# Altium project PCB_FinalProject.PrjPcb
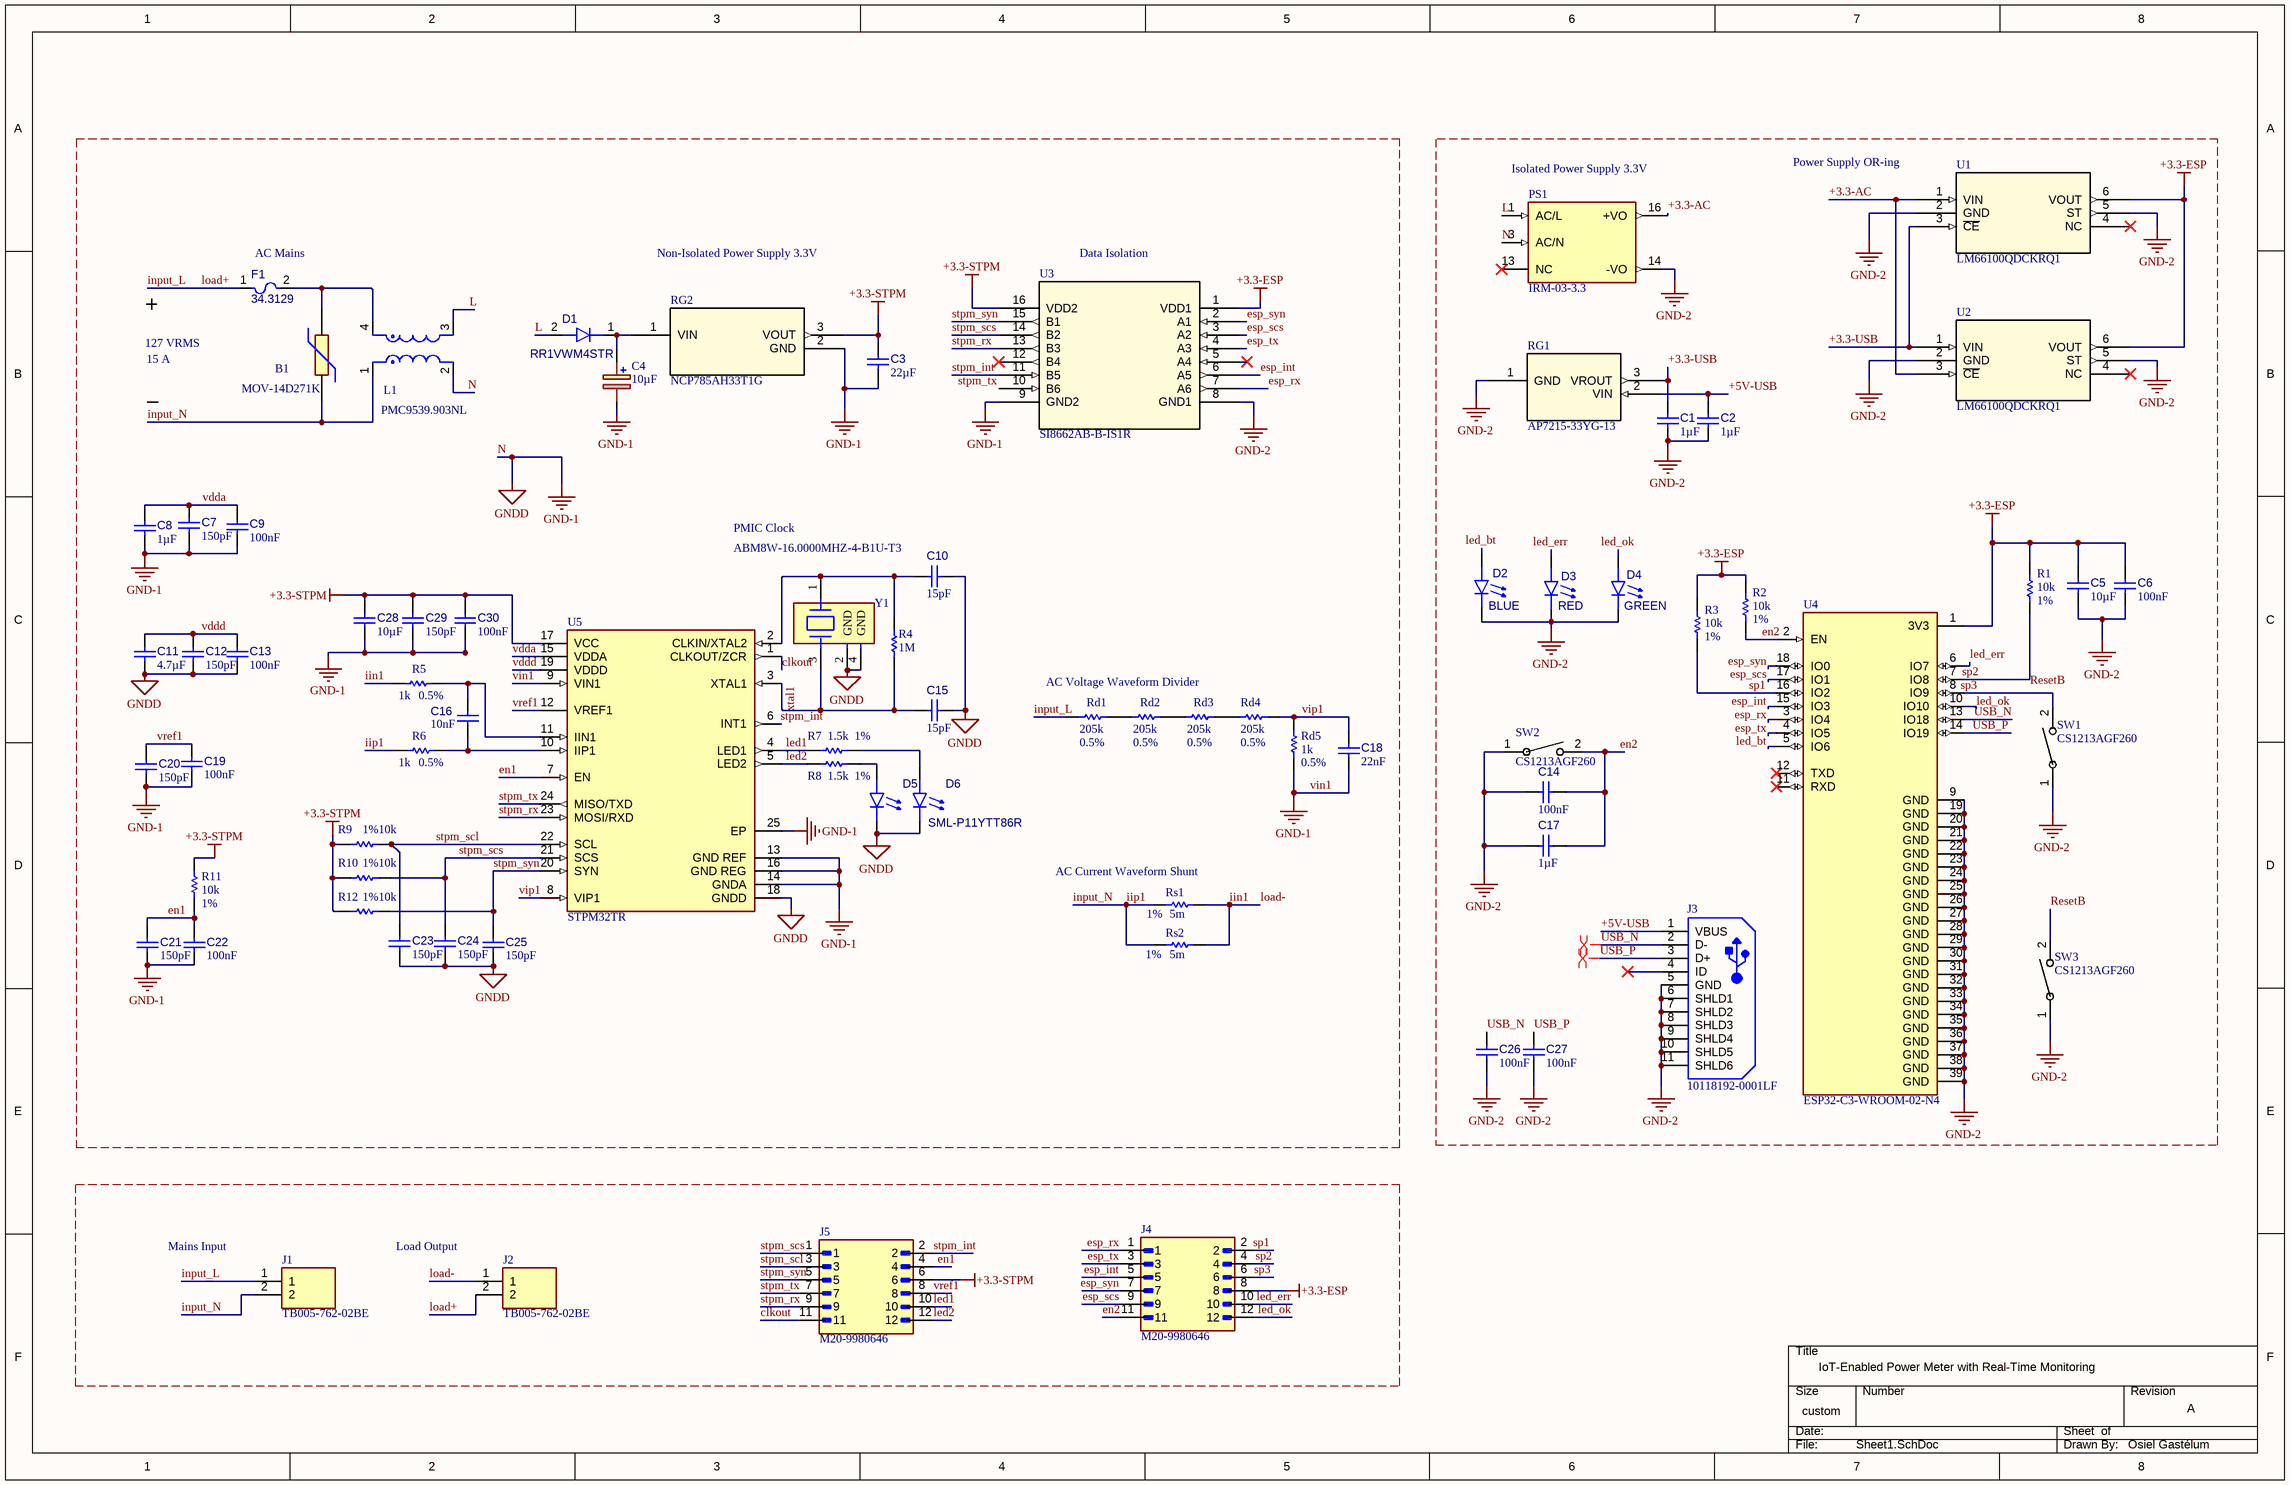
[diagram p0: Sheet1.SchDoc]
CAGE_CODE: ?????; CONTRACT_NUMBER: <CONTRACT NO>; DOC_NO_ASSY_DWG: <ASSY DWG NO>; DOC_NO_BOM: <BOM DOC NO>; DOC_NO_FAB_DWG: <FAB DWG NO>; DOC_NO_SCH_DWG: <SCH DWG NO>; PCB_2_DEC_TOL: +/-.01; PCB_3_DEC_TOL: +/-.010; PCB_ANG_TOL: +/-1/2; PCB_ASSEMBLY_NO: <PCB ASSY NO>; PCB_CHECKER: - -----; PCB_CHECKER_APP_DATE: --/--/----; PCB_DESIGNER: - -----; PCB_DESIGNER_APP_DATE: --/--/----; PCB_DWG_NO: <PCB DWG NO>; PCB_ENGINEER: - -----; PCB_ENGINEER_APP_DATE: --/--/----; PCB_PART_NUMBER: <PCB PN>; PCB_REV: A; SCH_REV: A
1 sheet, 75 parts. Net scope: global (net labels, ports and power ports of the same name join across sheets).
Board file: PCB.PcbDoc

## Sheet Sheet1.SchDoc: IoT-Enabled Power Meter
size 431 x 279 mm; Date: 26/03/2026; Author: Rene Lozano, Osiel Gastélum; Organization: CETYS Universidad; DocumentNumber: 1; Revision: A; SheetNumber: 1; SheetTotal: 1; Project: Final Project; ENG_APP_DATE: --/--/--; DSN_APP_DATE: --/--/--; CHK_APP_DATE: --/--/--

### Parts
B1  MOV-14D271K  [MOV14D271K]
C1  value 1µF  [CAP_0805_N]  (hidden comment: CAP-NP-2)
C2  value 1µF  [CAP_0805_N]  (hidden comment: CAP-NP-2)
C3  value 22µF  [CAP_0805_N]  (hidden comment: GRM21BR61E226ME44L)
C4  value 10µF  [CAPAE1030X1400N]  (hidden comment: AEF1013100M400R)
C5  value 10µF  [CAP_0805_N]  (hidden comment: CAP-NP-2)
C6  value 100nF  [CAP_0805_N]  (hidden comment: CAP-NP-2)
C7  value 150pF  [CAP_0805_N]  (hidden comment: CAP-NP-2)
C8  value 1µF  [CAP_0805_N]  (hidden comment: CAP-NP-2)
C9  value 100nF  [CAP_0805_N]  (hidden comment: CAP-NP-2)
C10  value 15pF  [CAP_0805_N]  (hidden comment: CAP-NP-2)
C11  value 4.7µF  [CAP_0805_N]  (hidden comment: CAP-NP-2)
C12  value 150pF  [CAP_0805_N]  (hidden comment: CAP-NP-2)
C13  value 100nF  [CAP_0805_N]  (hidden comment: CAP-NP-2)
C14  value 100nF  [CAP_0805_N]  (hidden comment: CAP-NP-2)
C15  15pF  [CAP_0805_N]
C16  value 10nF  [CAP_0805_N]  (hidden comment: C0805C103J3GECAUTO)
C17  value 1µF  [CAP_0805_N]  (hidden comment: CAP-NP-2)
C18  value 22nF  [CAP_0805_N]  (hidden comment: C0805C223J3GEC7210)
C19  value 100nF  [CAP_0805_N]  (hidden comment: CAP-NP-2)
C20  value 150pF  [CAP_0805_N]  (hidden comment: CAP-NP-2)
C21  value 150pF  [CAP_0805_N]  (hidden comment: CAP-NP-2)
C22  value 100nF  [CAP_0805_N]  (hidden comment: CAP-NP-2)
C23  value 150pF  [CAP_0805_N]  (hidden comment: CAP-NP-2)
C24  value 150pF  [CAP_0805_N]  (hidden comment: CAP-NP-2)
C25  value 150pF  [CAP_0805_N]  (hidden comment: CAP-NP-2)
C26  value 100nF  [CAP_0805_N]  (hidden comment: CAP-NP-2)
C27  value 100nF  [CAP_0805_N]  (hidden comment: CAP-NP-2)
C28  value 10µF  [CAP_0805_N]  (hidden comment: C0805C106K3PACTU)
C29  value 150pF  [CAP_0805_N]  (hidden comment: C0805C151K3GACTU)
C30  value 100nF  [CAP_0805_N]  (hidden comment: C0805C104K3RACTU)
D1  RR1VWM4STR  [PMDE_ROM]
D2  BLUE  [WL-SMCW_0805]
D3  RED  [WL-SMCW_0805]
D4  GREEN  [WL-SMCW_0805]
D5  SML-P11DTT86R  [LED_SML-P11D_ROM]  (value not drawn)
D6  SML-P11YTT86R  [LED_SML-P11D_ROM]
F1  34.3129  [3132873]
J1  TB005-762-02BE  [CUI_TB005-762-02BE]
J2  TB005-762-02BE  [CUI_TB005-762-02BE]
J3  10118192-0001LF  [FCI-10118192-0001LF-5_V]
J4  M20-9980646  [HARWIN_M20-9980646]
J5  M20-9980646  [HARWIN_M20-9980646]
L1  PMC9539.903NL  [PMC9539_PUL]
PS1  IRM-03-3.3  [CONV_IRM-03-3.3]
R1  value 10k  Tolerance: 1%  [RES_0805_N]  (hidden comment: RE0805FRE0710KL)
R2  value 10k  Tolerance: 1%  [RES_0805_N]  (hidden comment: RE0805FRE0710KL)
R3  value 10k  Tolerance: 1%  [RES_0805_N]  (hidden comment: RE0805FRE0710KL)
R4  value 1M  [RES_0805_N]  (hidden comment: RE0805FRE071ML)
R5  value 1k  Tolerance: 0.5%  [RES_0805_N]  (hidden comment: RT0805DRD071KL)
R6  value 1k  Tolerance: 0.5%  [RES_0805_N]  (hidden comment: RT0805DRD071KL)
R7  value 1.5k  Tolerance: 1%  [RES_0805_N]  (hidden comment: RE0805FRE071K5L)
R8  value 1.5k  Tolerance: 1%  [RES_0805_N]  (hidden comment: RE0805FRE071K5L)
R9  value 10k  Tolerance: 1%  [RES_0805_N]  (hidden comment: RE0805FRE0710KL)
R10  value 10k  Tolerance: 1%  [RES_0805_N]  (hidden comment: RE0805FRE0710KL)
R11  value 10k  Tolerance: 1%  [RES_0805_N]  (hidden comment: RE0805FRE0710KL)
R12  value 10k  Tolerance: 1%  [RES_0805_N]  (hidden comment: RE0805FRE0710KL)
Rd1  value 205k  Tolerance: 0.5%  [RES_0805_N]  (hidden comment: ERA-6AED2053V)
Rd2  value 205k  Tolerance: 0.5%  [RES_0805_N]  (hidden comment: ERA-6AED2053V)
Rd3  value 205k  Tolerance: 0.5%  [RES_0805_N]  (hidden comment: ERA-6AED2053V)
Rd4  value 205k  Tolerance: 0.5%  [RES_0805_N]  (hidden comment: ERA-6AED2053V)
Rd5  value 1k  Tolerance: 0.5%  [RES_0805_N]  (hidden comment: RT0805DRD071KL)
RG1  AP7215-33YG-13  [SOT-89-3_2P7X4P7_ONS-M]
RG2  NCP785AH33T1G  [SOT-89-3_2P7X4P7_ONS-M]
Rs1  value 5m  Tolerance: 1%  [RESC6430X100N]  (hidden comment: CSSU2512FT5L00)
Rs2  value 5m  Tolerance: 1%  [RESC6430X100N]  (hidden comment: CSSU2512FT5L00)
SW1  CS1213AGF260  [SW_CS1213AGF260_CRS]
SW2  CS1213AGF260  [SW_CS1213AGF260_CRS]
SW3  CS1213AGF260  [SW_CS1213AGF260_CRS]
U1  LM66100QDCKRQ1  [SC70-6_DCK_TEX]
U2  LM66100QDCKRQ1  [SC70-6_DCK_TEX]
U3  SI8662AB-B-IS1R  [SOIC-16_SIL]
U4  ESP32-C3-WROOM-02-N4  [MODULE_ESP32-C3-WROOM-02-H4]
U5  STPM32TR  [FP-QFN24L-7596209-IPC_B]
Y1  ABM8W-16.0000MHZ-4-B1U-T3  [FP-ABM8W-MFG]

### Nets
+3.3-ESP: C5.1 C6.2 J4.8 R1.1 R2.1 R3.1 U1.6(VOUT) U2.6(VOUT) U3.1(VDD1) U4.1(3V3)
+3.3-STPM: C3.2 C28.2 C29.2 C30.2 J5.6 R9.2 R10.2 R11.2 R12.2 RG2.3(VOUT) U3.16(VDD2) U5.17(VCC)
GND-2: C1.1 C2.1 C5.2 C6.1 C14.2 C17.1 C26.1 C27.1 D2.1(K) D3.1(K) D4.1(K) J3.5(GND) J3.6(SHLD1) J3.7(SHLD2) J3.8(SHLD3) J3.9(SHLD4) J3.10(SHLD5) J3.11(SHLD6) PS1.14(-VO) RG1.1(GND) SW1.1 SW2.1 SW3.1 U1.2(GND) U1.5(ST) U2.2(GND) U2.5(ST) U3.8(GND1) U4.9(GND) U4.19(GND) U4.20(GND) U4.21(GND) U4.22(GND) U4.23(GND) U4.24(GND) U4.25(GND) U4.26(GND) U4.27(GND) U4.28(GND) U4.29(GND) U4.30(GND) U4.31(GND) U4.32(GND) U4.33(GND) U4.34(GND) U4.35(GND) U4.36(GND) U4.37(GND) U4.38(GND) U4.39(GND)
N: C3.1 C4.2(-) C7.1 C8.1 C9.1 C10.1 C11.1 C12.1 C13.1 C15.1 C18.1 C19.1 C20.1 C21.1 C22.1 C23.1 C24.1 C25.1 C28.1 C29.1 C30.1 D5.1(K) D6.1(K) L1.2 PS1.3(AC/N) Rd5.2 RG2.2(GND) U3.9(GND2) U5.9(VIN1) U5.13(GND_REF) U5.14(GNDA) U5.16(GND_REG) U5.18(GNDD) U5.25(EP) Y1.2(GND) Y1.4(GND)  [also labelled GND-1, GNDD, vin1]
+3.3-AC: PS1.16(+VO) U1.1(VIN) U2.3(~{C}~{E})
+3.3-USB: C1.2 RG1.3(VROUT) U1.3(~{C}~{E}) U2.1(VIN)
+5V-USB: C2.2 J3.1(VBUS) RG1.2(VIN)
clkout: J5.11 U5.1(CLKOUT/ZCR)
en1: C21.2 C22.2 J5.4 R11.1 U5.7(EN)
en2: C14.1 C17.2 J4.11 R2.2 SW2.2 U4.2(EN)
esp_int: J4.5 U3.6(A5) U4.15(IO3)
esp_rx: J4.1 U3.7(A6) U4.3(IO4)
esp_scs: J4.9 U3.3(A2) U4.17(IO1)
esp_syn: J4.7 U3.2(A1) U4.18(IO0)
esp_tx: J4.3 U3.4(A3) U4.4(IO5)
iin1: J2.1 R5.1 Rs1.2 Rs2.2  [also labelled load-]
iip1: B1.1 J1.2 L1.1 R6.1 Rs1.1 Rs2.1  [also labelled input_N]
input_L: F1.1 J1.1 J2.2 Rd1.1  [also labelled load+]
L: D1.2(A) L1.3 PS1.1(AC/L)
led1: J5.10 R7.1 U5.4(LED1)
led2: J5.12 R8.1 U5.5(LED2)
led_bt: D2.2(A) U4.5(IO6)
led_err: D3.2(A) J4.10 U4.6(IO7)
led_ok: D4.2(A) J4.12 U4.10(IO10)
ResetB: J4.4 R1.2 SW3.2 U4.7(IO8)  [also labelled sp2]
sp1: J4.2 R3.2 U4.16(IO2)
sp3: J4.6 SW1.2 U4.8(IO9)
stpm_int: J5.2 U3.11(B5) U5.6(INT1)
stpm_rx: J5.9 U3.13(B3) U5.23(MOSI/RXD)
stpm_scl: C23.2 J5.3 R9.1 U5.22(SCL)
stpm_scs: C24.2 J5.1 R10.1 U3.14(B2) U5.21(SCS)
stpm_syn: C25.2 J5.5 R12.1 U3.15(B1) U5.20(SYN)
stpm_tx: J5.7 U3.10(B6) U5.24(MISO/TXD)
USB_N: C26.2 J3.2(D-) U4.13(IO18)
USB_P: C27.2 J3.3(D+) U4.14(IO19)
vdda: C7.2 C8.2 C9.2 U5.15(VDDA)
vddd: C11.2 C12.2 C13.2 U5.19(VDDD)
vip1: C18.2 Rd4.1 Rd5.1 U5.8(VIP1)
vref1: C19.2 C20.2 J5.8 U5.12(VREF1)
xtal1: C15.2 R4.1 U5.3(XTAL1) Y1.3
NetB1_2: B1.2 F1.2 L1.4
NetC4_1: C4.1(+) D1.1(K) RG2.1(VIN)
NetC10_2: C10.2 R4.2 U5.2(CLKIN/XTAL2) Y1.1
NetC16_1: C16.1 R6.2 U5.10(IIP1)
NetC16_2: C16.2 R5.2 U5.11(IIN1)
NetD5_2: D5.2(A) R8.2
NetD6_2: D6.2(A) R7.2
NetRd1_2: Rd1.2 Rd2.2
NetRd2_1: Rd2.1 Rd3.2
NetRd3_1: Rd3.1 Rd4.2

Not connected (* = marked no-connect by the designer): J3 4(ID)*; PS1 13(NC)*; U1 4(NC)*; U2 4(NC)*; U3 5(A4)* 12(B4)*; U4 11(RXD)* 12(TXD)*

### Layout directives
differential pair: USB_N, USB_P

### Notes on the sheet
- Power Supply OR-ing
- (near PS1) Isolated Power Supply 3.3V
- (near F1) AC Mains
- Non-Isolated Power Supply 3.3V
- (near U3) Data Isolation
- 127 VRMS
- 15 A
- PMIC Clock
- AC Voltage Waveform Divider
- (near Rs1) AC Current Waveform Shunt
- Mains Input
- (near J2) Load Output
- IoT-Enabled Power Meter with Real-Time Monitoring
- A
- Osiel Gastélum
- DWG. NO.
- REV.
- SHT.
- THIS DOCUMENT AND THE DATA DISCLOSED HEREIN OR HEREWITH IS THE PROPERTY OF ALTIUM LIMITED AND MAY BE FREELY DISTRIBUTED IN WHOLE. NO RIGHTS ARE RESERVED OR EXPRESS OR IMPLIED WARANTEE GIVEN.
- REVISION
- DESCRIPTION
- DATE
- APPROVED
- ENG:
- APPROVALS
- PROJECT
- DSN:
- CHK:
- REFERENCE DOCUMENTS
- PROJECT REVISION:
- TITLE
- DOCUMENT REVISION:
- DESIGN ITEM:
- BOM:
- FAB DWG:
- PCB DWG:
- ASSY DWG:
- SCALE:
- SIZE
- B
- CAGE CODE
- FILE NAME
- DWG NO.
- SHEET
- OF
- REV

### Library data of the parts
B1 = CMP-00030-00002-4: Var MOV 175VAC/225VDC 4500A 270V Thru-Hole Radial Bulk; Case/Package: Radial; Min Operating Temperature: -40°C; Max Operating Temperature: 105°C; Mounting Technology: Radial, Through Hole
C1 C2 C8 C17 = CMP-001-00100-1: Multilayer Ceramic Capacitors MLCC – SMD/SMT; KEMET; C0805C105K3RACTU; 1 µF; 0805; 25 V; 25 V; Tolerance: 10%; Voltage Rating: 25V; Mounting Technology: Surface Mount; Case/Package: 0805; Min Operating Temperature: -55°C; Max Operating Temperature: 125°C; Pins: 2
C3 = CMP-001-00092-3: 25V 22uF X5R ±20% 0805 Multilayer Ceramic Capacitors MLCC - SMD/SMT ROHS; Min Operating Temperature: -55°C; Tolerance: 20%; Voltage Rating: 25V; Case/Package: 0805; Mounting Technology: Surface Mount; Max Operating Temperature: 85°C
C4 = CMP-001-00086-1: Aluminum Electrolytic Capacitor, Polarized, Aluminum (wet), 400V, 20% +Tol, 20% -Tol, 10uF, Surface Mount, 4141; Ripple Current: 97mA; Max Operating Temperature: 105°C; Mounting Technology: Surface Mount; Min Operating Temperature: -40°C
C5 C28 = CMP-001-00098-1: 0805 C 10UF Ceramic Multilayer Capacitor, 25 VDC, +85DEGC, X5R Dielec, +/-10%; Voltage Rating: 25V; Tolerance: 10%; Max Operating Temperature: 85°C; Case/Package: 0805; Min Operating Temperature: -55°C; Mounting Technology: Surface Mount
C6 C9 C13 C14 C19 C22 C26 C27 C30 = CMP-001-00097-1: 25V 100nF X7R ±10% 0805 Multilayer Ceramic Capacitors MLCC - SMD/SMT ROHS; Tolerance: 10%; Min Operating Temperature: -55°C; Voltage Rating: 25V; Case/Package: 0805; Mounting Technology: Surface Mount; Pins: 2; Max Operating Temperature: 125°C
C7 C12 C20 C21 C23-C25 C29 = CMP-001-00096-1: SMD Comm C0G 0805 (2012Metric) Ceramic Capacitor 0.079Lx0.049W 2.00mmx1.25mm C0G NP0 ±10% 150pF; Voltage Rating: 25V; Tolerance: 10%; Mounting Technology: Surface Mount; Min Operating Temperature: -55°C; Case/Package: 0805; Max Operating Temperature: 125°C
C10 C15 = CMP-001-00095-2: Ceramic Capacitor, Multilayer, Ceramic, 25V, 5% +Tol, 5% -Tol, C0G, 30ppm/Cel TC, 0.000015uF, Surface Mount, 0805; Mounting Technology: Surface Mount; Case/Package: 0805; Tolerance: 5%; Max Operating Temperature: 125°C; Min Operating Temperature: -55°C; Voltage Rating: 25V
  C15: Value: 15pF
C11 = CMP-001-00101-1: Ceramic Capacitor, Multilayer, Ceramic, 25V, 10% +Tol, 10% -Tol, X7R, 15% TC, 4.7uF, Surface Mount, 0805; Max Operating Temperature: 125°C; Min Operating Temperature: -55°C; Mounting Technology: Surface Mount; Case/Package: 0805
C16 = CMP-001-00093-2: Ceramic Capacitor, Multilayer, Ceramic, 25V, 5% +Tol, 5% -Tol, C0G, 30ppm/Cel TC, 0.01uF, Surface Mount, 0805; Mounting Technology: Surface Mount; Max Operating Temperature: 125°C; Min Operating Temperature: -55°C
C18 = CMP-001-00094-1: Ceramic Capacitor, Multilayer, Ceramic, 25V, 5% +Tol, 5% -Tol, C0G, 30ppm/Cel TC, 0.022uF, Surface Mount, 0805; Max Operating Temperature: 125°C; Mounting Technology: Surface Mount; Min Operating Temperature: -55°C
D1 = CMP-004-00034-3: Rectifier Diode, 1 Phase, 1 Element, 1A, 400V V(RRM), Silicon; Max Operating Temperature: 175°C; Mounting Technology: Surface Mount
D2 = CMP-007-00045-1: Led, Blue, 470 Nm, 3.2 V, 30 Ma, 145 Mcd Rohs Compliant: Yes; Forward Voltage: 3.2V; Forward Current: 100mA; Min Operating Temperature: -40°C; Max Operating Temperature: 85°C; Case/Package: 0805; Mounting Technology: Surface Mount
D3 = CMP-007-00039-1: LED Uni-Color Red 630nm 2-Pin Chip 0805(2012Metric) T/R; Forward Current: 100mA; Forward Voltage: 2V; Mounting Technology: Surface Mount; Case/Package: 0805; Max Operating Temperature: 85°C; Min Operating Temperature: -40°C
D4 = CMP-004-00033-3: 0805, Green Typ.(@20mA): 520nm, 450mcd, 3.2V, 140Â° InGaN; Forward Voltage: 2V; MP: 150080GS75000; Forward Current: 100mA; MF: Wurth Electronics; Design Item ID: WL-SMCW_0805; Min Operating Temperature: -40°C; Component Type: Standard; Value: *; Pins: 2; Source: WL-SMCW_0805.SchLib; Max Operating Temperature: 85°C; Case/Package: 0805; Check_prices: https://www.snapeda.com/parts/150080GS75000/Wurth+Electronics/view-part/?ref=eda; SnapEDA_Link: https://www.snapeda.com/parts/150080GS75000/Wurth+Electronics/view-part/?ref=snap; Mounting Technology: Surface Mount
D5 = CMP-007-00036-4: LED orange LED0402 wavelength 605nm light intensity 7.3mcd Front Mounting; Forward Voltage: 2.1V; Forward Current: 20mA; Mounting Technology: Surface Mount; Pins: 2; Min Operating Temperature: -40°C; Case/Package: 0402; Max Operating Temperature: 85°C
D6 = CMP-007-00037-4: LED Uni-Color Yellow Chip LED 2-Pin 0402 T/R; Forward Current: 20mA; Forward Voltage: 2.1V; Pins: 2; Max Operating Temperature: 85°C; Case/Package: 0402; Mounting Technology: Surface Mount; Min Operating Temperature: -40°C
F1 = CMP-005-00013-1: Fuse 5 x 20 mm, 16 A, T, 250 V (AC), 160 A breaking capacity, 0034.3129
J1 J2 = CMP-002-00074-2: 2~24 Poles, Screw Type, Horizontal, 7.62 Pitch, 26~10 (AWG), Terminal Block Connector; MF: Same Sky; SnapEDA_Link: https://www.snapeda.com/parts/TB005-762-02BE/Same+Sky/view-part/?ref=snap; MP: TB005-762-02BE; Component Type: Standard; Pins: 2; Design Item ID: TB005-762-02BE; Source: TB005-762-02BE.SchLib; Value: *; Case/Package: None; Check_prices: https://www.snapeda.com/parts/TB005-762-02BE/Same+Sky/view-part/?ref=eda
J3 = CMP-002-00071-1: Usb Connector, 5 Contact(S), Female, Right Angle, Surface Mount Terminal, Locking, Receptacle; Connector Type: Receptacle, USB; Voltage Rating: 100V; Min Operating Temperature: -30°C; Mounting Technology: Horizontal, Surface Mount; Pins: 5; Max Operating Temperature: 80°C; Gender: Receptacle
J4 J5 = CMP-002-00075-1: Board Connector, 12 Contact(s), 1 Row(s), Male, Straight, Solder Terminal; Max Current Rating: 3A; Connector Type: Male Pin; Max Operating Temperature: 105°C; Gender: Male; Min Operating Temperature: -40°C; Pins: 12; Mounting Technology: Through Hole
L1 = CMP-012-00001-6: 250惟@2.1MHz 1.3m惟 2 Plugin, 19.6x17.8mm Common Mode Filters ROHS; Current Rating: 25A; Min Operating Temperature: -40°C; Max Operating Temperature: 125°C
PS1 = CMP-020-000000-1: DC-DC Converter, PCB Mnt, 3W, 3.3V@600mA, IRM-03 Series; MF: MEAN WELL USA Inc.; Pin Count: 5; Value: *; Source: IRM-03-3.3.SchLib; MP: IRM-03-3.3; Design Item ID: IRM-03-3.3; Package: None; Component Type: Standard; Check_prices: https://www.snapeda.com/parts/IRM-03-3.3/Mean+Well/view-part/?ref=eda; SnapEDA_Link: https://www.snapeda.com/parts/IRM-03-3.3/Mean+Well/view-part/?ref=snap
R1-R3 R9-R12 = CMP-009-00182-2: Res Thick Film 0805 10K Ohm 1% 1/8W ±50ppm/°C Molded SMD Paper T/R; Min Operating Temperature: -55°C; Mounting Technology: Surface Mount; Max Operating Temperature: 155°C; Case/Package: 0805
R4 = CMP-009-00185-2: Res, 1M, 1%, 0.125W, 0805, Thick Film Rohs Compliant: Yes; Max Operating Temperature: 155°C; Mounting Technology: Surface Mount; Tolerance: 1%; Case/Package: 0805; Min Operating Temperature: -55°C
R5 R6 Rd5 = CMP-009-00181-3: 125mW Thin Film Resistor 150V ±0.5% ±25ppm/℃ 1kΩ 0805 Chip Resistor - Surface Mount ROHS; Mounting Technology: Surface Mount; Max Operating Temperature: 155°C; Voltage Rating: 150V; Case/Package: 0805; Min Operating Temperature: -55°C
R7 R8 = CMP-009-00184-2: Chip Resistor Precision Grade Thick Film 0805 1.5kOhm 1% Paper T/R; Mounting Technology: Surface Mount; Case/Package: 0805; Max Operating Temperature: 155°C; Min Operating Temperature: -55°C
Rd1-Rd4 = CMP-009-00180-5: Res Thin Film 0805 205K Ohm 0.5% 0.125W(1/8W) ±25ppm/C Pad SMD Automotive T/R; Voltage Rating: 100V; Case/Package: 0805; Max Operating Temperature: 155°C; Min Operating Temperature: -55°C; Mounting Technology: Surface Mount
RG1 = CMP-019-00051-11: Voltage Regulators, LDO, SOT89-3L 3.3V/0.6A 250MV 3.3-5.5V 1.2V; Min Supply Voltage: 3.3V; Max Supply Voltage: 5.5V; Output Current: 600mA; Max Power Dissipation: 790mW; Case/Package: SOT-89-3; Max Operating Temperature: 85°C; Dropout Voltage: 250mV; Min Operating Temperature: -40°C; Output Voltage: 3.3V; Pins: 3; Mounting Technology: Surface Mount
RG2 = CMP-019-00049-8: NCP785A Series 3.3 V 10 mA High Performance Linear Regulator - SOT-89; Max Supply Voltage: 450V; Output Voltage: 3.3V; Output Current: 10mA; Pins: 3; Min Operating Temperature: -40°C; Case/Package: SOT-89-3; Max Operating Temperature: 85°C; Mounting Technology: Surface Mount
Rs1 Rs2 = CMP-009-00178-3: Fixed Resistor, 5W, 0.005ohm, 0.158V, 1% +/-Tol, 50ppm/Cel, Surface Mount, 2512; Mounting Technology: Surface Mount; Max Operating Temperature: 170°C; Min Operating Temperature: -55°C
SW1-SW3 = CMP-011-00014-2: Description; Manufacturer_Name: CIT Relay & Switch; Design Item ID: CS1213AGF260; Manufacturer_Part_Number: CS1213AGF260; Type: Tactile Switches; Copyright: Copyright (C) 2025 Ultra Librarian. All rights reserved.; Source: CS1213AGF260.SchLib
U1 U2 = CMP-031-00008-6: Automotive 1.5-V to 5.5-V, 1.5-A, 0.5-µA IQ ideal diode with integrated FET 6-SC70 -40 to 125; Pins: 6
U3 = CMP-00026-00001-3: General Purpose tal Isolator 2500Vrms 6 Channel 1Mbps 35kV/µs CMTI 16-SOIC (0.154 , 3.90mm Width); Max Operating Temperature: 125°C; Min Operating Temperature: -40°C; Case/Package: SOIC
U4 = CMP-031-00009-1: WiFi Modules (802.11) (Engineering Samples) SMD module, ESP32-C3, 4MB SPI flash, PCB antenna, -40 C +85 C; MF: Espressif Systems; Check_prices: https://www.snapeda.com/parts/ESP32-C3-WROOM-02-N4/Espressif+Systems/view-part/?ref=eda; Price: None; Purchase-URL: https://pricing.snapeda.com/search/part/ESP32-C3-WROOM-02-N4/?ref=eda; SnapEDA_Link: https://www.snapeda.com/parts/ESP32-C3-WROOM-02-N4/Espressif+Systems/view-part/?ref=snap; Case/Package: Package; Availability: In Stock; Component Type: Standard; MP: ESP32-C3-WROOM-02-N4; Source: ESP32-C3-WROOM-02-N4.SchLib; Value: *; Pins: 39; Design Item ID: ESP32-C3-WROOM-02-N4
U5 = CMP-031-00006-2: STPM32 Series 3.3 V 4.3 mA 3.6 kHz Single Phase Metering IC - QFN-24; Max Supply Voltage: 3.65V; Min Supply Voltage: 2.95V; Min Operating Temperature: -40°C; Mounting Technology: Surface Mount; Case/Package: QFN; Pins: 24; Max Operating Temperature: 85°C
Y1 = CMP-003-00030-1: Crystal 16MHz ±10ppm (Tol) ±10ppm (Stability) 4pF FUND 70Ohm 4-Pin SMD T/R; ESR: 40; Load Capacitance: 4pF; Frequency: 16MHz; Max Operating Temperature: 70°C; Min Operating Temperature: -20°C; Mounting Technology: Surface Mount